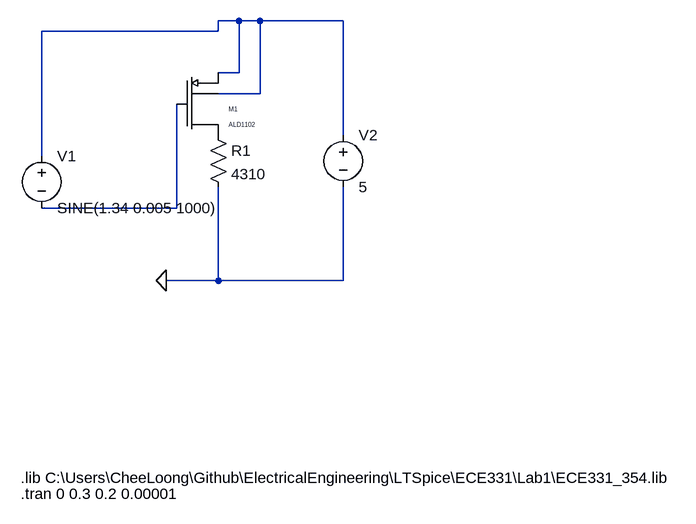
[diagram p0: schematic Lab1_2_6_Soon_Wang.asc]
Lab1_2_6_Soon_Wang.asc, the LTspice schematic file:
Version 4
SHEET 1 908 680
WIRE -208 -176 -240 -176
WIRE -176 -176 -208 -176
WIRE -48 -176 -176 -176
WIRE -240 -160 -240 -176
WIRE -240 -160 -512 -160
WIRE -208 -96 -208 -176
WIRE -208 -96 -240 -96
WIRE -176 -64 -176 -176
WIRE -176 -64 -240 -64
WIRE -48 0 -48 -176
WIRE -512 32 -512 -160
WIRE -304 112 -304 -48
WIRE -304 112 -512 112
WIRE -240 224 -240 80
WIRE -240 224 -320 224
WIRE -48 224 -48 80
WIRE -48 224 -240 224
FLAG -320 224 0
SYMBOL voltage -512 16 R0
WINDOW 123 0 0 Left 2
WINDOW 39 0 0 Left 2
SYMATTR InstName V1
SYMATTR Value SINE(1.34 0.005 1000)
SYMBOL res -256 -16 R0
SYMATTR InstName R1
SYMATTR Value 4310
SYMBOL voltage -48 -16 R0
WINDOW 123 0 0 Left 2
WINDOW 39 0 0 Left 2
SYMATTR InstName V2
SYMATTR Value 5
SYMBOL ALD1102 -304 -96 R0
SYMATTR InstName M1
TEXT -544 528 Left 2 !.lib C:\\Users\\CheeLoong\\Github\\ElectricalEngineering\\LTSpice\\ECE331\\Lab1\\ECE331_354.lib
TEXT -544 552 Left 2 !.tran 0 0.3 0.2 0.00001

The netlist it stands for:
* Lab1_2_6_Soon_Wang.asc
V1 N001 N002 SINE(1.34 0.005 1000)
R1 P001 0 4310
V2 N001 0 5
M1 P001 N002 N001 N001 ALD1102 W=1.739e-3 L=1e-6
.model NMOS NMOS
.model PMOS PMOS
.lib standard.mos
.lib C:\Users\CheeLoong\Github\ElectricalEngineering\LTSpice\ECE331\Lab1\ECE331_354.lib
.tran 0 0.3 0.2 0.00001
.backanno
.end